# EAGLE design board_power_supply_lm26480 (EAGLE 7.5.0)
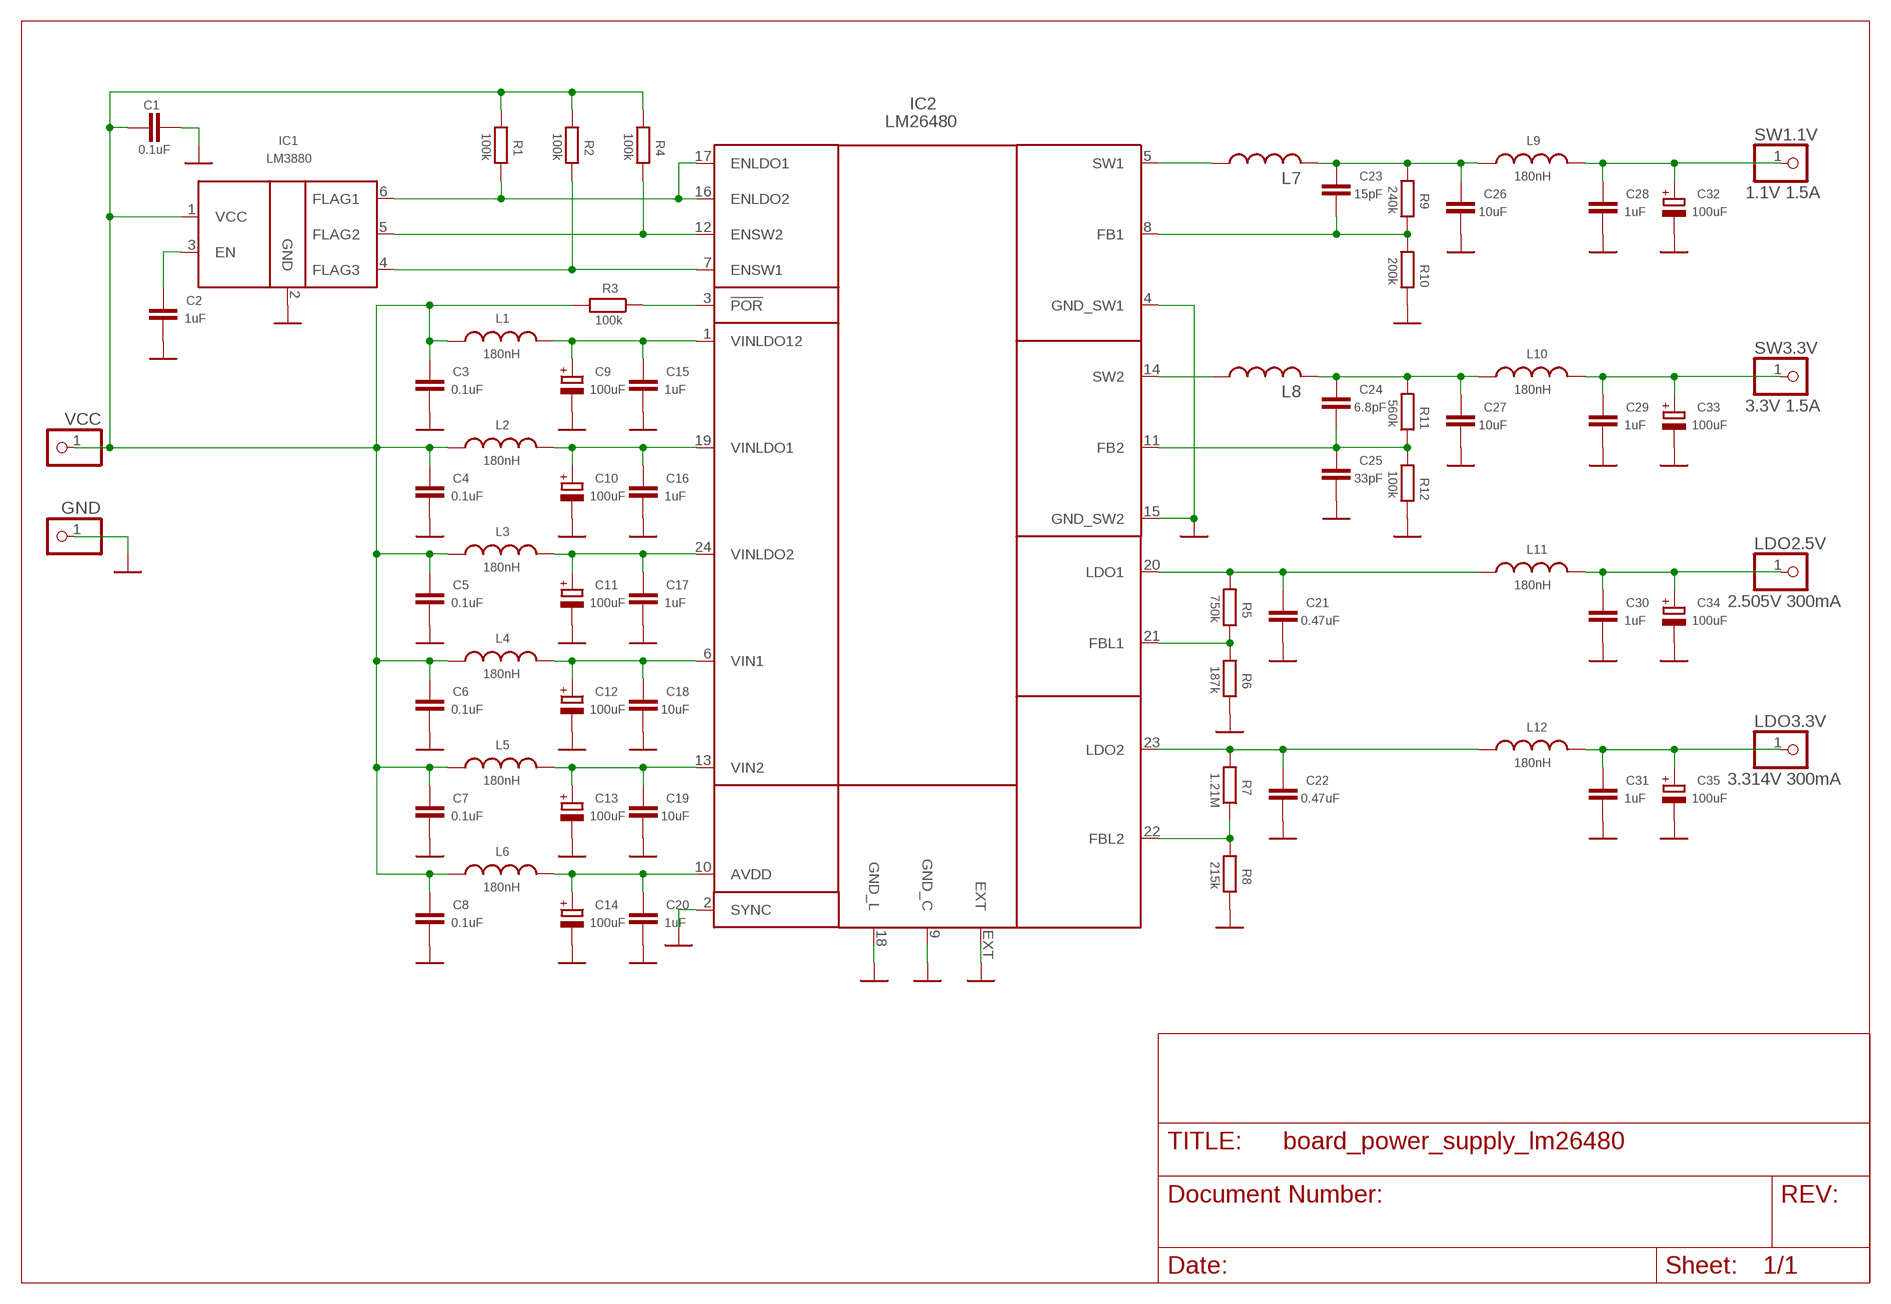
[diagram p0: schematic, sheet 1]

## Parts
C1  0.1uF  C0603  [SMD0603]
C2  1uF  C0603  [SMD0603]
C3  0.1uF  C0603  [SMD0603]
C4  0.1uF  C0603  [SMD0603]
C5  0.1uF  C0603  [SMD0603]
C6  0.1uF  C0603  [SMD0603]
C7  0.1uF  C0603  [SMD0603]
C8  0.1uF  C0603  [SMD0603]
C9  100uF  CPOLSMC_B  [SMC_B]
C10  100uF  CPOLSMC_B  [SMC_B]
C11  100uF  CPOLSMC_B  [SMC_B]
C12  100uF  CPOLSMC_B  [SMC_B]
C13  100uF  CPOLSMC_B  [SMC_B]
C14  100uF  CPOLSMC_B  [SMC_B]
C15  1uF  C0402  [SMD0402]
C16  1uF  C0402  [SMD0402]
C17  1uF  C0402  [SMD0402]
C18  10uF  C0805  [SMD0805]
C19  10uF  C0805  [SMD0805]
C20  1uF  C0402  [SMD0402]
C21  0.47uF  C0603  [SMD0603]
C22  0.47uF  C0603  [SMD0603]
C23  15pF  C0603  [SMD0603]
C24  6.8pF  C0603  [SMD0603]
C25  33pF  C0603  [SMD0603]
C26  10uF  C0805  [SMD0805]
C27  10uF  C0805  [SMD0805]
C28  1uF  C0603  [SMD0603]
C29  1uF  C0603  [SMD0603]
C30  1uF  C0603  [SMD0603]
C31  1uF  C0603  [SMD0603]
C32  100uF  CPOLSMC_B  [SMC_B]
C33  100uF  CPOLSMC_B  [SMC_B]
C34  100uF  CPOLSMC_B  [SMC_B]
C35  100uF  CPOLSMC_B  [SMC_B]
GND  PINHD-1X1  [1X01]
IC1  LM3880  [SOT23-6]
IC2  LM26480  LM26480SQ-AA/NOPB  [WQFN24]
L1  180nH  L0603  [SMD0603]
L2  180nH  L0603  [SMD0603]
L3  180nH  L0603  [SMD0603]
L4  180nH  L0603  [SMD0603]
L5  180nH  L0603  [SMD0603]
L6  180nH  L0603  [SMD0603]
L7  L2825  [L2825P]
L8  L2825  [L2825P]
L9  180nH  L0603  [SMD0603]
L10  180nH  L0603  [SMD0603]
L11  180nH  L0603  [SMD0603]
L12  180nH  L0603  [SMD0603]
LDO2.5V  PINHD-1X1  [1X01]
LDO3.3V  PINHD-1X1  [1X01]
R1  100k  R0603  [SMD0603]
R2  100k  R0603  [SMD0603]
R3  100k  R0402  [SMD0402]
R4  100k  R0603  [SMD0603]
R5  750k  R0603  [SMD0603]
R6  187k  R0603  [SMD0603]
R7  1.21M  R0603  [SMD0603]
R8  215k  R0603  [SMD0603]
R9  240k  R0603  [SMD0603]
R10  200k  R0603  [SMD0603]
R11  560k  R0603  [SMD0603]
R12  100k  R0603  [SMD0603]
SW1.1V  PINHD-1X1  [1X01]
SW3.3V  PINHD-1X1  [1X01]
VCC  PINHD-1X1  [1X01]

## Nets
GND: C1.1 C2.2 C3.2 C4.2 C5.2 C6.2 C7.2 C8.2 C9.- C10.- C11.- C12.- C13.- C14.- C15.2 C16.2 C17.2 C18.2 C19.2 C20.2 C21.2 C22.2 C25.2 C26.2 C27.2 C28.2 C29.2 C30.2 C31.2 C32.- C33.- C34.- C35.- GND.1 IC1.2(GND) IC2.2(SYNC) IC2.4(GND_SW1) IC2.9(GND_C) IC2.15(GND_SW2) IC2.18(GND_L) IC2.EXT R6.1 R8.1 R10.1 R12.1
N$2: C23.1 C26.1 L7.2 L9.1 R9.2
N$3: C23.2 IC2.8(FB1) R9.1 R10.2
N$4: IC2.5(SW1) L7.1
N$5: C24.2 C25.1 IC2.11(FB2) R11.1 R12.2
N$6: IC2.14(SW2) L8.1
N$7: IC2.3(!POR) R3.1
N$9: C9.+ C15.1 IC2.1(VINLDO12) L1.2
N$10: IC2.21(FBL1) R5.1 R6.2
N$11: IC2.22(FBL2) R7.1 R8.2
N$12: C21.1 IC2.20(LDO1) L11.1 R5.2
N$13: C10.+ C16.1 IC2.19(VINLDO1) L2.2
N$14: C11.+ C17.1 IC2.24(VINLDO2) L3.2
N$15: C12.+ C18.1 IC2.6(VIN1) L4.2
N$16: C24.1 C27.1 L8.2 L10.1 R11.2
N$18: C13.+ C19.1 IC2.13(VIN2) L5.2
N$19: C14.+ C20.1 IC2.10(AVDD) L6.2
N$20: C28.1 C32.+ L9.2 SW1.1V.1
N$21: C29.1 C33.+ L10.2 SW3.3V.1
N$23: C30.1 C34.+ L11.2 LDO2.5V.1
N$24: C22.1 IC2.23(LDO2) L12.1 R7.2
N$25: C31.1 C35.+ L12.2 LDO3.3V.1
N$26: IC1.5(FLAG2) IC2.12(ENSW2) R4.1
N$27: IC1.4(FLAG3) IC2.7(ENSW1) R2.1
N$28: IC1.6(FLAG1) IC2.16(ENLDO2) IC2.17(ENLDO1) R1.1
N$31: C2.1 IC1.3(EN)
VCC: C1.2 C3.1 C4.1 C5.1 C6.1 C7.1 C8.1 IC1.1(VCC) L1.1 L2.1 L3.1 L4.1 L5.1 L6.1 R1.2 R2.2 R3.2 R4.2 VCC.1

## Notes on the sheet
- 1.1V 1.5A
- 3.3V 1.5A
- 2.505V 300mA
- 3.314V 300mA

## Library data of the parts
C1-C8 C15-C31 = common-rcl:C
C9-C14 C32-C35 = common-rcl:CPOL
GND LDO2.5V LDO3.3V SW1.1V SW3.3V VCC = pinhead:PINHD-1X1: PIN HEADER
IC1 = texas-instruments:LM3880: TIMING DESIGNATOR td1 td2 td3 td4 td5 td6 AA 10 ms 10 ms 10 ms 10 ms 10 ms 10 ms AB 30 ms 30 ms 30 ms 30 ms 30 ms 30 ms AC 60 ms 60 ms 60 ms 60 ms 60 ms 60 ms AD 120 ms 120 ms 120 ms 120 ms 120 ms 120 ms AE 2 ms 2 ms 2 ms 2 ms 2 ms 2 ms AF 16 ms 16 ms 16 ms 16 ms 16 ms 16 ms
IC2 = texas-instruments:LM26480
L1-L12 = common-rcl:L
R1-R12 = common-rcl:R

## Board
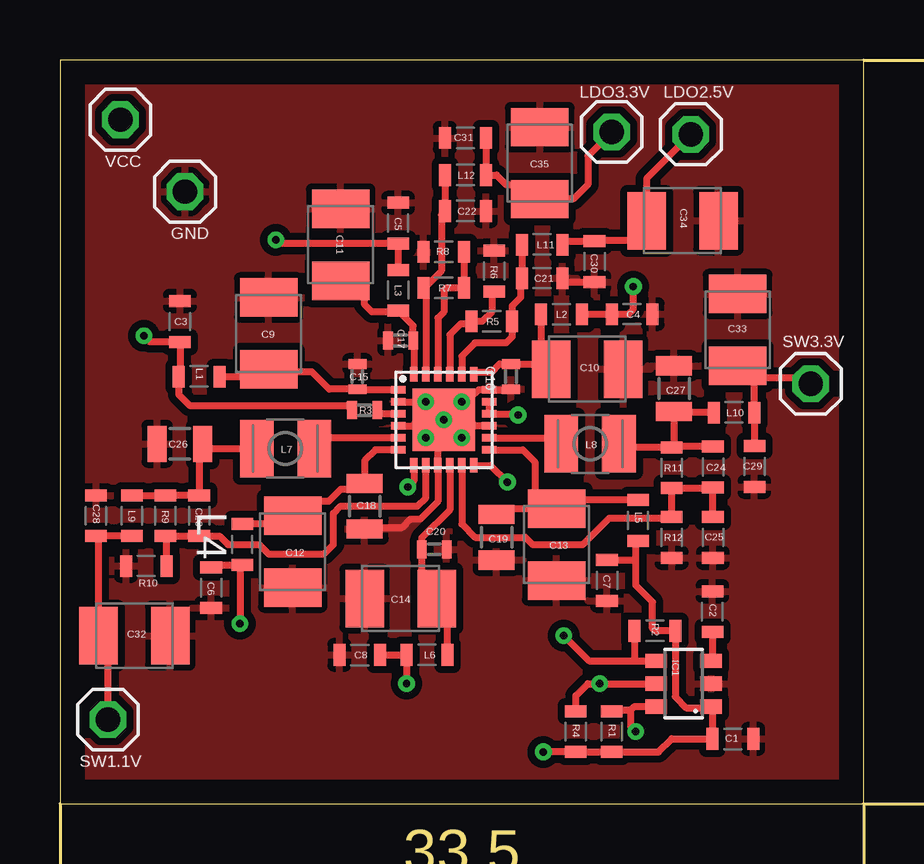
[diagram p1: board, top side]
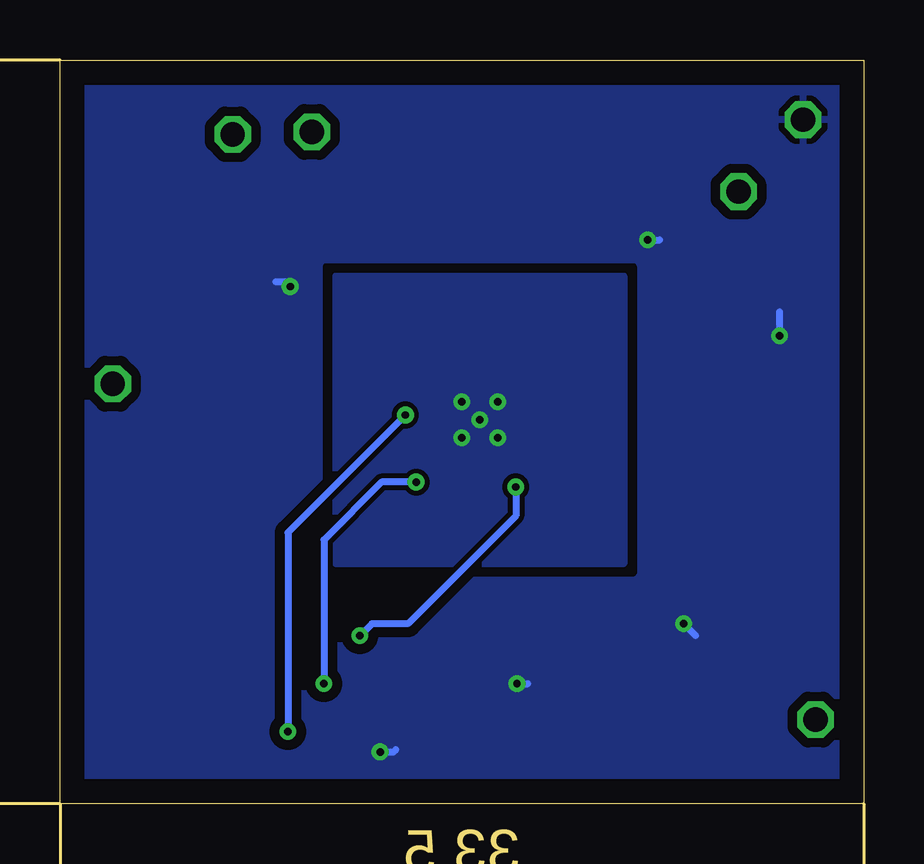
[diagram p2: board, bottom side, seen from below]

Size 33.5 x 31 mm. Coordinates in mm from the lower left corner, seen from the top.
Outline: 0,0 33.5,0 33.5,31 0,31 0,0
Copper layers (1*16): Top 0.035mm / dielectric 1.5mm / Bottom 0.035mm
Design rules "default": minimum track width 10mil, minimum drill 24mil, track to track 8mil, track to pad 8mil, pad to pad 8mil, via to via 8mil, smd to smd 8mil, copper to edge 40mil, drill to drill 8mil, minimum pad ring 10mil, minimum via ring 8mil, stop-mask expansion 4mil, vias tented up to drill 0mil, thermal gap 10mil
Milling: area 0,-3.5 to 1.5,-3; area 32,-3.5 to 33.5,-3; area 14,-2.9 to 19.5,-1.1; area 36.7,29.5 to 37.3,31; area 36.7,0 to 37.3,1.5; area 37.4,14.1 to 39.2,16.9; 6 lines

### Footprints (pad centres in the part's own frame; a part is rotated, then mirrored left to right if it is on the bottom)
SMD0603 = smd 0.5 x 0.9: 1 -0.85,0; 2 0.85,0
SMC_B = smd 1.6 x 2.4: + -1.5,0; - 1.5,0
SMD0402 = smd 0.4 x 0.75: 1 -0.523,0; 2 0.523,0
SMD0805 = smd 0.8 x 1.5: 1 -0.95,0; 2 0.95,0
1X01 = drill 1.016 octagon: 1 0,0
SOT23-6 = smd 0.6 x 0.9: 1 -0.95,-1.15; 2 0,-1.15; 3 0.95,-1.15; 4 0.95,1.15; 5 0,1.15; 6 -0.95,1.15
WQFN24 = smd 0.3 x 0.6: 1 1.25,1.9; 2 0.75,1.9; 3 0.25,1.9; 4 -0.25,1.9; 5 -0.75,1.9; 6 -1.25,1.9; 13 -1.25,-1.9; 14 -0.75,-1.9; 15 -0.25,-1.9; 16 0.25,-1.9; 17 0.75,-1.9; 18 1.25,-1.9 | smd 0.6 x 0.3: 7 -1.9,1.25; 8 -1.9,0.75; 9 -1.9,0.25; 10 -1.9,-0.25; 11 -1.9,-0.75; 12 -1.9,-1.25; 19 1.9,-1.25; 20 1.9,-0.75; 21 1.9,-0.25; 22 1.9,0.25; 23 1.9,0.75; 24 1.9,1.25 | smd 2.6 x 2.6: EXT 0,0
L2825P = smd 1.4 x 2.4: 1 -1.2,0; 2 1.2,0

### Placement (x,y rotation side)
C1  28.05,2.7 180 top
C2  27.2,8 90 top
C3  5,20.1 90 top
C4  23.85,20.4 0 top
C5  14.1,24.2 90 top
C6  6.3,9 270 top
C7  22.8,9.3 270 top
C8  12.5,6.2 180 top
C9  8.7,19.6 90 top
C10  21.98,18.11 0 top
C11  11.7,23.3 90 top
C12  9.7,10.5 270 top
C13  20.7,10.8 270 top
C14  14.2,8.55 180 top
C15  12.4,17.8 90 top
C16  18.8,17.8 270 top
C17  14.2,19.3 180 top
C18  12.7,12.4 270 top
C19  18.2,11.1 270 top
C20  15.6,10.6 0 top
C21  20.1,21.9 0 top
C22  16.9,24.7 0 top
C23  5.8,12 270 top
C24  27.22,14.03 270 top
C25  27.22,11.09 270 top
C26  5,15 180 top
C27  25.6,17.3 90 top
C28  1.5,12 90 top
C29  28.95,14.05 270 top
C30  22.28,22.59 270 top
C31  16.9,27.75 180 top
C32  3.1,7 0 top
C33  28.25,19.75 90 top
C34  25.95,24.3 0 top
C35  20,26.7 90 top
GND  5.21,25.51 0 top
IC1  26,5 90 top
IC2  16,16 90 top
L1  5.8,17.8 0 top
L2  20.9,20.4 180 top
L3  14.1,21.4 270 top
L4  7.6,10.8 90 top
L5  24.1,11.8 90 top
L6  15.3,6.2 0 top
L7  9.4,14.8 180 top
L8  22.1,15 0 top
L9  3,12 270 top
L10  28.1,16.3 0 top
L11  20.1,23.3 0 top
L12  16.9,26.2 0 top
LDO2.5V  26.3,27.9 0 top
LDO3.3V  23,28 0 top
R1  23,3 270 top
R2  24.8,7.2 0 top
R3  12.7,16.4 180 top
R4  21.5,3 270 top
R5  18,20.1 0 top
R6  18.1,22.2 270 top
R7  16,21.5 180 top
R8  16,23 0 top
R9  4.4,12 90 top
R10  3.6,9.9 0 top
R11  25.5,14 90 top
R12  25.5,11.1 90 top
SW1.1V  2,3.5 0 top
SW3.3V  31.3,17.5 0 top
VCC  2.52,28.51 0 top

### Tracks (layer width: path | path; a pad name or v marks a point on that pad's centre or on a via)
GND  (via drill 0.3)
  Top 0.3: IC2.2 v15.25,16.75 | v15.25,16.75 15.75,16.75 16,16.5 IC2.EXT | IC2.4 15.75,15.75 | 15.75,15.75 IC2.EXT | IC2.15 16.25,15.75 IC2.EXT | C16.2 18.8,17.25 IC2.18 17.45,17.25 17.1,16.9 16.9,16.9 v16.75,16.75 IC2.EXT | C21.2 21.11,21.74 C30.2 | v16.75,15.25 IC2.EXT | 15.75,15.75 v15.25,15.25 15.75,14.75 IC2.9 15.75,12.6 15,11.85 14.6,11.85 14.25,11.5 12.75,11.5 C18.2 | v15.25,16.75 IC2.EXT
  other vias: 16,16
  pour Top (isolate 0.3, rank 6): 0,31 33.5,31 33.5,0 0,0
  pour Bottom: 10,10 22,10 22,22 10,22
N$2
  Top 0.3: L9.1 R9.2 C23.1 5.8,14.65 C26.1 6.15,14.8 L7.2
N$3
  Top 0.3: R10.2 4.45,11.1 R9.1 C23.2 6.65,11.15 7,10.8 8.3,10.8 8.7,10.4 11,10.4 11.4,10.8 11.4,12.1 11.7,12.4 14.9,12.4 15.25,12.75 IC2.8
N$4
  Top 0.3: IC2.5 11.05,15.25 L7.1
N$5
  Top 0.3: 27.19,13.15 R11.1 R12.2 arc-90 25.45,11.9 22.9,11.9 21.8,10.8 19.7,10.8 19.4,11.1 17.3,11.1 16.75,11.65 IC2.11 | 27.19,13.15 C24.2 | 27.19,13.15 27.19,11.87 C25.1
N$6
  Top 0.3: IC2.14 20.65,15.25 L8.1
N$7
  Top 0.3: IC2.3 13.37,16.25 R3.1
N$9
  Top 0.3: IC2.1 12.73,17.25 C15.1 11.22,17.28 10.5,18 8.8,18 C9.+ | 8.7,17.65 C9.+ | L1.2 8.4,17.8 C9.+
N$10
  Top 0.3: IC2.21 16.25,19.55 16.7,20 17.05,20 R5.1 17.6,20.1 18,20.5 18,21.25 R6.2
N$11
  Top 0.3: IC2.22 15.75,20.25 16,20.5 16,21.4 16.1,21.5 R7.1 R8.2
N$12
  Top 0.3: IC2.20 16.75,18.65 17.3,19.2 18.6,19.2 18.85,19.45 R5.2 18.85,20.75 19.2,21.1 19.2,21.85 C21.1 L11.1
N$13
  Top 0.3: L2.2 20.05,18.24 C10.+ 20.48,18.32 C16.1 18.32,18.32 18,18 17.35,18 IC2.19
N$14
  Top 0.3: IC2.24 14.75,19.07 C17.1 14.72,19.93 L3.2 14.05,20.5 13,20.5 12.7,20.8 12.7,21.7 12.6,21.8 C11.+
N$15
  Top 0.3: IC2.6 13.15,14.75 12.7,14.3 C18.1 12.25,13.35 12,13.1 11.7,13.1 11.2,12.6 10.3,12.6 C12.+ 9.35,11.65 L4.2
N$16
  Top 0.3: C24.1 25.53,14.88 | L8.2 23.45,14.85 R11.2 25.53,14.88 | 25.53,14.88 25.6,14.95 C27.1 25.65,16.3 L10.1
N$18
  Top 0.3: L5.2 21.75,12.65 C13.+ 20,12.3 | C19.1 18.2,12.3 20,12.3 | IC2.13 19.3,14.75 19.8,14.25 19.8,12.5 20,12.3
N$19
  Top 0.3: L6.2 16.15,8.35 C14.+ 15.08,9.17 C20.1 15.08,11.08 16.25,12.25 IC2.10
N$20
  Top 0.3: L9.2 C28.1 1.6,11.05 C32.+ 2,6.6 SW1.1V.1
N$21
  Top 0.3: 28.95,17.75 L10.2 C29.1 | 28.95,17.75 28.95,18.5 28.75,18.5 28.75,18.25 C33.+ | SW3.3V.1 31.3,17.75 28.95,17.75
N$23
  Top 0.3: L11.2 21.09,23.44 C30.1 22.34,23.5 24.5,23.5 24.45,23.55 C34.+ 24.45,26.05 LDO2.5V.1
N$24
  Top 0.3: IC2.23 15.25,21.4 R7.2 15.2,21.5 15.9,22.2 15.9,24.55 C22.1 L12.1
N$25
  Top 0.3: LDO3.3V.1 22,27 22,25.8 21.4,25.2 C35.+ 19.4,25.8 18.6,25.8 18.2,26.2 L12.2 C31.1
N$26  (via drill 0.3)
  Top 0.3: R4.1 21.5,4.5 22,5 v22.5,5 IC1.5 | IC2.12 17.95,14.1 v18.65,13.4
  Bottom 0.3: v22.5,5 22.5,11 20.1,13.4 v18.65,13.4
N$27  (via drill 0.3)
  Top 0.3: IC2.7 14.75,13.45 v14.5,13.2 | v21,7 22.05,5.95 24,5.95 | 24,5.95 IC1.4 | R2.1 23.95,6 arc90 24,5.95
  Bottom 0.3: v14.5,13.2 14.5,12 19,7.5 20.5,7.5 v21,7
N$28  (via drill 0.3)
  Top 0.3: IC2.17 IC2.16 19.05,16.25 v19.1,16.2 | R1.1 23.05,3.9 23.8,3.9 | 23.8,3.9 23.95,4.05 IC1.6 | v24,3 23.8,3.2 23.8,3.9
  Bottom 0.3: v19.1,16.2 24,11.3 v24,3
N$31
  Top 0.3: C2.1 27.2,6 IC1.3
VCC  (via drill 0.3)
  Top 0.3: C8.1 L6.1 v14.45,5 | C6.1 6.4,9.95 L4.1 7.5,9.85 v7.5,7.5 | R3.2 11.98,16.6 5.4,16.6 4.95,17.05 L1.1 5,17.85 C3.1 3.75,19.25 v3.5,19.5 | 24,10 24,9.1 24.7,8.4 24.7,7.3 24.8,7.2 R2.2 25.65,4.45 26.1,4 27.1,4 IC1.1 27.2,4 C1.2 25.5,2.7 24.95,2.15 R1.2 R4.2 v20.15,2.15 | 24,10 24,10.85 L5.1 | C7.1 23.85,10.15 arc-90 24,10 | v9,23.5 9.15,23.35 C5.1 L3.1 | v23.9,21.55 23.9,20.6 23.7,20.4 C4.1 L2.1
  Bottom 0.3: v3.5,19.5 3.5,20.5 | v9,23.5 8.5,23.5 | v7.5,7.5 7,7 | v23.9,21.55 24,21.75 24.5,21.75 | v14.45,5 14,5 | v20.15,2.15 19.6,2.15 19.5,2.25
  pour Bottom (isolate 0.4, rank 6): 0,31 33.5,31 33.5,0 0,0